# EAGLE schematic pwr_supply (EAGLE 5.10)
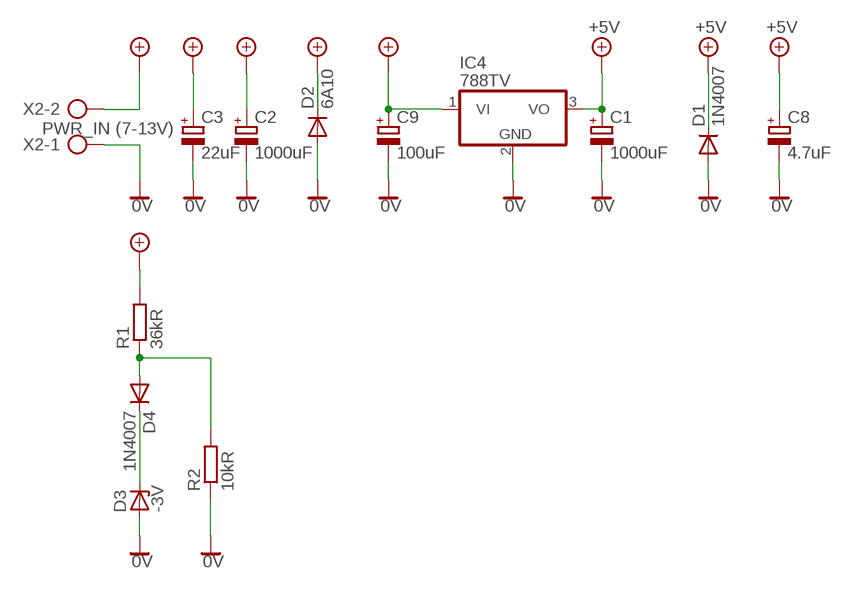
[diagram p0: schematic, sheet 1]

## Parts
C1  1000uF  CPOL-EUE3.5-10  [E3,5-10]
C2  1000uF  CPOL-EUE3.5-10  [E3,5-10]
C3  22uF  CPOL-EUE3.5-10  [E3,5-10]
C8  4.7uF  CPOL-EUE2.5-7  [E2,5-7]
C9  100uF  CPOL-EUE3.5-10  [E3,5-10]
D1  1N4007  1N4004  [DO41-10]
D2  6A10  UF5400  [DO201-15]
D3  -3V  ZENER-DIODEF126-10  [F126Z10]
D4  1N4007  1N4004  [DO41-10]
IC4  788TV  [TO220V]
R1  36kR  R-EU_0207/12  [0207/12]
R2  10kR  R-EU_0207/12  [0207/12]
X2  PWR_IN (7-13V)  AK300/2  [AK300/2]

## Nets
0V: C1.- C2.- C3.- D2.A D3.A R2.1
+5V: C1.+ C8.+ D1.C IC4.3(VO)
+9V: C2.+ C3.+ C9.+ D2.C IC4.1(VI) R1.2 X2.2
AAA: C8.- C9.- D1.A IC4.2(GND) X2.1 ; supply symbol labelled 0V
N$1: D3.C D4.C
N$2: D4.A R1.1 R2.2

## Library data of the parts
C1-C3 C8 C9 = rcl:CPOL-EU: POLARIZED CAPACITOR, European symbol
D1 D4 = diode:1N4004: DIODE general purpose rectifier, 1 A
D2 = diode:UF5400: DIODE ultra fast rectifier, 3 A
D3 = diode:ZENER-DIODE: Z-Diode
IC4 = linear:78*: Positive VOLTAGE REGULATOR Source: http://cache.national.com/ds/LM/LM78L05.pdf http://www.fairchildsemi.com/ds/LM/LM7805.pdf
R1 R2 = rcl:R-EU_: RESISTOR, European symbol
X2 = con-ptr500:AK300/2: CONNECTOR